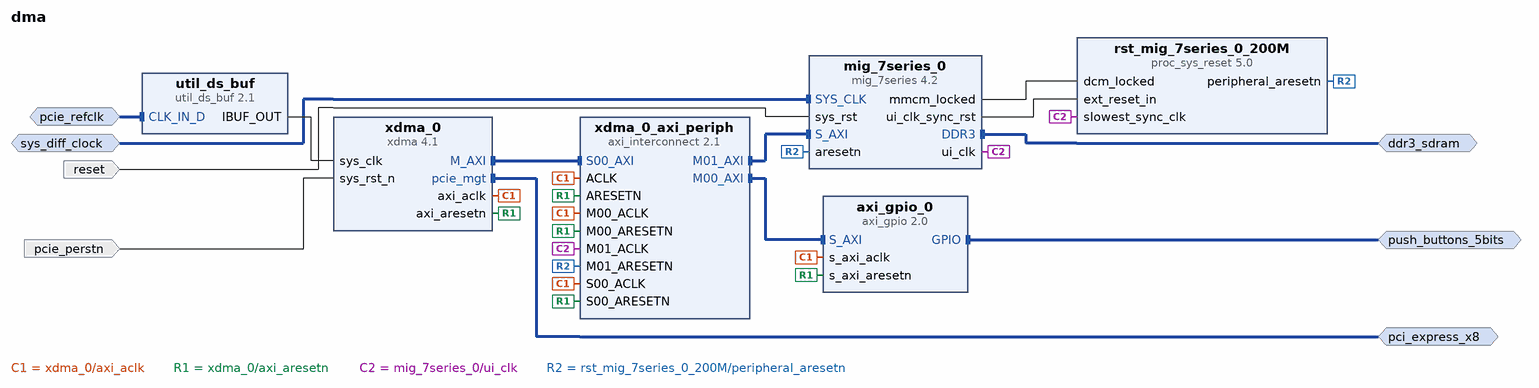
[diagram p0: block diagram of the top level]
# Vivado block design dma, xc7k325tffg900-2, Vivado 2020.2
create_bd_design dma

create_bd_intf_port -mode Master -vlnv xilinx.com:interface:gpio_rtl:1.0 push_buttons_5bits
create_bd_intf_port -mode Master -vlnv xilinx.com:interface:pcie_7x_mgt_rtl:1.0 pci_express_x8
create_bd_intf_port -mode Master -vlnv xilinx.com:interface:ddrx_rtl:1.0 ddr3_sdram
create_bd_intf_port -mode Slave -vlnv xilinx.com:interface:diff_clock_rtl:1.0 sys_diff_clock
set_property -dict {CONFIG.FREQ_HZ 100000000} [get_bd_intf_ports sys_diff_clock]
create_bd_intf_port -mode Slave -vlnv xilinx.com:interface:diff_clock_rtl:1.0 pcie_refclk
set_property -dict {CONFIG.FREQ_HZ 100000000} [get_bd_intf_ports pcie_refclk]
create_bd_port -dir I -type rst pcie_perstn
set_property -dict {CONFIG.POLARITY ACTIVE_LOW} [get_bd_ports pcie_perstn]
create_bd_port -dir I -type rst reset
set_property -dict {CONFIG.POLARITY ACTIVE_HIGH} [get_bd_ports reset]

create_bd_cell -type ip -vlnv xilinx.com:ip:axi_gpio:2.0 axi_gpio_0
set_property -dict {CONFIG.GPIO_BOARD_INTERFACE push_buttons_5bits CONFIG.USE_BOARD_FLOW true} [get_bd_cells axi_gpio_0]
create_bd_cell -type ip -vlnv xilinx.com:ip:xdma:4.1 xdma_0
set_property -dict [list \
  CONFIG.PCIE_BOARD_INTERFACE pci_express_x8 \
  CONFIG.SYS_RST_N_BOARD_INTERFACE pcie_perstn \
  CONFIG.axi_data_width 128_bit \
  CONFIG.axisten_freq 250 \
  CONFIG.pl_link_cap_max_link_speed 5.0_GT/s \
  CONFIG.xdma_axi_intf_mm AXI_Memory_Mapped \
] [get_bd_cells xdma_0]
create_bd_cell -type ip -vlnv xilinx.com:ip:mig_7series:4.2 mig_7series_0
set_property -dict {CONFIG.BOARD_MIG_PARAM ddr3_sdram CONFIG.RESET_BOARD_INTERFACE reset} [get_bd_cells mig_7series_0]
create_bd_cell -type ip -vlnv xilinx.com:ip:util_ds_buf:2.1 util_ds_buf
set_property -dict {CONFIG.DIFF_CLK_IN_BOARD_INTERFACE pcie_refclk CONFIG.USE_BOARD_FLOW true} [get_bd_cells util_ds_buf]
create_bd_cell -type ip -vlnv xilinx.com:ip:axi_interconnect:2.1 xdma_0_axi_periph
set_property -dict {CONFIG.NUM_MI 2} [get_bd_cells xdma_0_axi_periph]
create_bd_cell -type ip -vlnv xilinx.com:ip:proc_sys_reset:5.0 rst_mig_7series_0_200M

# ---- connections ----

connect_bd_intf_net [get_bd_intf_ports push_buttons_5bits] [get_bd_intf_pins axi_gpio_0/GPIO]
connect_bd_intf_net [get_bd_intf_ports pci_express_x8] [get_bd_intf_pins xdma_0/pcie_mgt]
connect_bd_intf_net [get_bd_intf_pins xdma_0/M_AXI] [get_bd_intf_pins xdma_0_axi_periph/S00_AXI]
connect_bd_intf_net [get_bd_intf_ports pcie_refclk] [get_bd_intf_pins util_ds_buf/CLK_IN_D]
connect_bd_intf_net [get_bd_intf_ports sys_diff_clock] [get_bd_intf_pins mig_7series_0/SYS_CLK]
connect_bd_intf_net [get_bd_intf_ports ddr3_sdram] [get_bd_intf_pins mig_7series_0/DDR3]
connect_bd_intf_net [get_bd_intf_pins xdma_0_axi_periph/M00_AXI] [get_bd_intf_pins axi_gpio_0/S_AXI]
connect_bd_intf_net [get_bd_intf_pins xdma_0_axi_periph/M01_AXI] [get_bd_intf_pins mig_7series_0/S_AXI]
connect_bd_net [get_bd_ports pcie_perstn] [get_bd_pins xdma_0/sys_rst_n]
connect_bd_net [get_bd_pins util_ds_buf/IBUF_OUT] [get_bd_pins xdma_0/sys_clk]
connect_bd_net [get_bd_pins xdma_0/axi_aclk] \
  [get_bd_pins xdma_0_axi_periph/S00_ACLK] [get_bd_pins axi_gpio_0/s_axi_aclk] [get_bd_pins xdma_0_axi_periph/M00_ACLK] \
  [get_bd_pins xdma_0_axi_periph/ACLK]
connect_bd_net [get_bd_pins xdma_0/axi_aresetn] \
  [get_bd_pins xdma_0_axi_periph/S00_ARESETN] [get_bd_pins axi_gpio_0/s_axi_aresetn] \
  [get_bd_pins xdma_0_axi_periph/M00_ARESETN] [get_bd_pins xdma_0_axi_periph/ARESETN]
connect_bd_net [get_bd_pins mig_7series_0/ui_clk] [get_bd_pins xdma_0_axi_periph/M01_ACLK] [get_bd_pins rst_mig_7series_0_200M/slowest_sync_clk]
connect_bd_net [get_bd_pins mig_7series_0/mmcm_locked] [get_bd_pins rst_mig_7series_0_200M/dcm_locked]
connect_bd_net [get_bd_pins mig_7series_0/ui_clk_sync_rst] [get_bd_pins rst_mig_7series_0_200M/ext_reset_in]
connect_bd_net [get_bd_pins rst_mig_7series_0_200M/peripheral_aresetn] [get_bd_pins mig_7series_0/aresetn] [get_bd_pins xdma_0_axi_periph/M01_ARESETN]
connect_bd_net [get_bd_ports reset] [get_bd_pins mig_7series_0/sys_rst]

# ---- address map ----
assign_bd_address -offset 0x0000000040000000 -range 64K -target_address_space [get_bd_addr_spaces xdma_0/M_AXI] [get_bd_addr_segs axi_gpio_0/S_AXI/Reg]
assign_bd_address -offset 0x0000000080000000 -range 1G -target_address_space [get_bd_addr_spaces xdma_0/M_AXI] [get_bd_addr_segs mig_7series_0/memmap/memaddr]

validate_bd_design
save_bd_design
